# EAGLE schematic LMDoorAlarm (EAGLE 9.5.2)
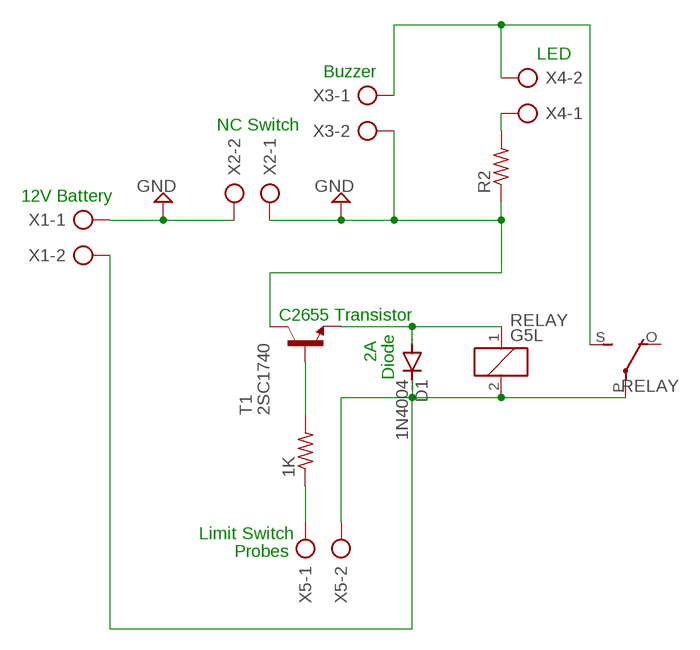
[diagram p0: schematic, sheet 1]

## Parts
1K  R-US_0207/10  [0207/10]
D1  1N4004  [DO41-10]
R2  R-US_0207/10  [0207/10]
RELAY  G5L  [G5LE]
T1  2SC1740  [TO92-ECB]
X1  AK500/2  [AK500/2]
X2  AK500/2  [AK500/2]
X3  AK500/2  [AK500/2]
X4  AK500/2  [AK500/2]
X5  AK500/2  [AK500/2]

## Nets
GND: R2.1 T1.C X1.1 X2.1 X2.2 X3.2
N$1: R2.2 X4.1
N$2: RELAY.S(2:S) X3.1 X4.2
N$3: D1.A RELAY.1 T1.E
N$4: 1K.2 T1.B
N$5: 1K.1 X5.1
N$6: D1.C RELAY.2 RELAY.P(2:P) X1.2 X5.2
Unconnected: RELAY.O(2:O)

## Notes on the sheet
- LED
- Buzzer
- NC Switch
- 12V Battery
- C2655 Transistor
- 2A
- Diode
- Limit Switch
- Probes

## Library data of the parts
1K R2 = rcl:R-US_: RESISTOR, American symbol; SPICEPREFIX: R
D1 = diode:1N4004: DIODE general purpose rectifier, 1 A
RELAY = relay:G5L: RELAY 1 x switch, 10 A/120 V AC, 8 A/30 V ADC, Omron; OC_FARNELL: unknown; OC_NEWARK: unknown
T1 = transistor:2SC1740: NPN Silicon Epitaxial Planar Transistor Source: SEMTECH ELECTRONICS LTD. 2SC1740.pdf
X1-X5 = con-ptr500:AK500/2: CONNECTOR; OC_FARNELL: unknown; OC_NEWARK: unknown